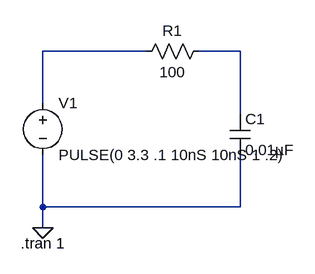
[diagram p0: schematic Cap_Edge_Soften.asc]
Cap_Edge_Soften.asc, the LTspice schematic file:
Version 4
SHEET 1 880 680
WIRE 240 48 80 48
WIRE 384 48 320 48
WIRE 80 128 80 48
WIRE 384 144 384 48
WIRE 80 288 80 208
WIRE 384 288 384 208
WIRE 384 288 80 288
WIRE 80 320 80 288
FLAG 80 320 0
SYMBOL voltage 80 112 R0
WINDOW 123 0 0 Left 0
WINDOW 39 0 0 Left 0
SYMATTR InstName V1
SYMATTR Value PULSE(0 3.3 .1 10nS 10nS 1 .2)
SYMBOL res 336 32 R90
WINDOW 0 0 56 VBottom 2
WINDOW 3 32 56 VTop 2
SYMATTR InstName R1
SYMATTR Value 100
SYMBOL cap 368 144 R0
SYMATTR InstName C1
SYMATTR Value 0.01µF
TEXT 46 344 Left 2 !.tran 1

The netlist it stands for:
* Cap_Edge_Soften.asc
V1 N001 0 PULSE(0 3.3 .1 10nS 10nS 1 .2)
R1 N002 N001 100
C1 N002 0 0.01µF
.tran 1
.backanno
.end